# Altium schematic sheet REV0.3.SchDoc
size A
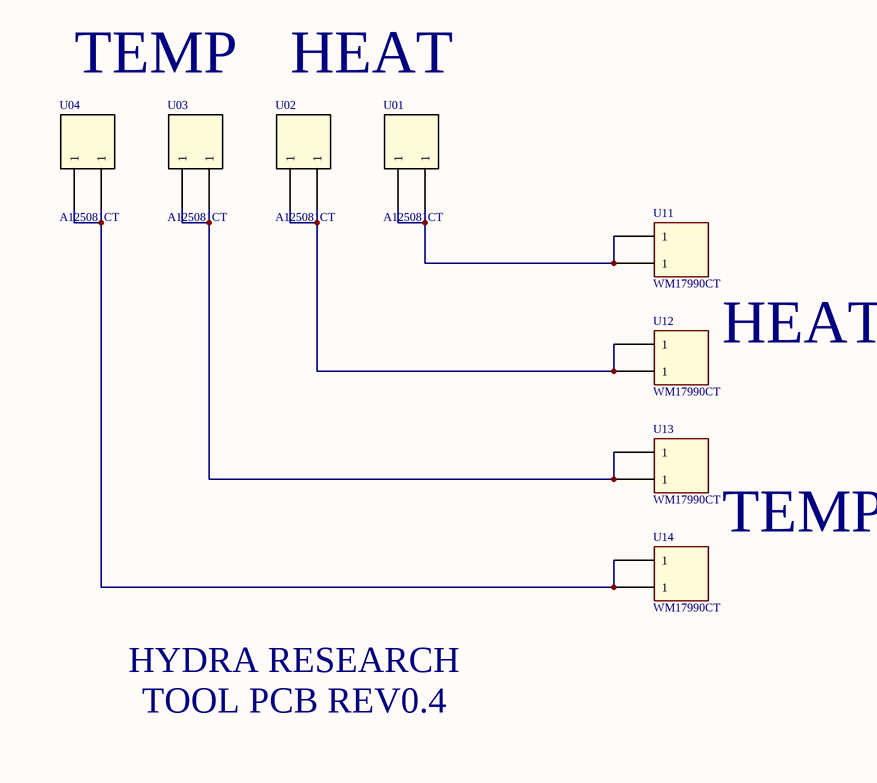
[diagram p0: REV0.3.SchDoc]

## Parts
U01  A125081CT  [A125081CT-ND]
U02  A125081CT  [A125081CT-ND]
U03  A125081CT  [A125081CT-ND]
U04  A125081CT  [A125081CT-ND]
U11  WM17990CT  [WM17990CT-ND-l]
U12  WM17990CT  [WM17990CT-ND-l]
U13  WM17990CT  [WM17990CT-ND-l]
U14  WM17990CT  [WM17990CT-ND-l]

## Nets
NetU01_1: U01.1 U11.1
NetU02_1: U02.1 U12.1
NetU03_1: U03.1 U13.1
NetU04_1: U04.1 U14.1

## Notes on the sheet
- TEMP
- HEAT
- HYDRA RESEARCH
- TOOL PCB REV0.4